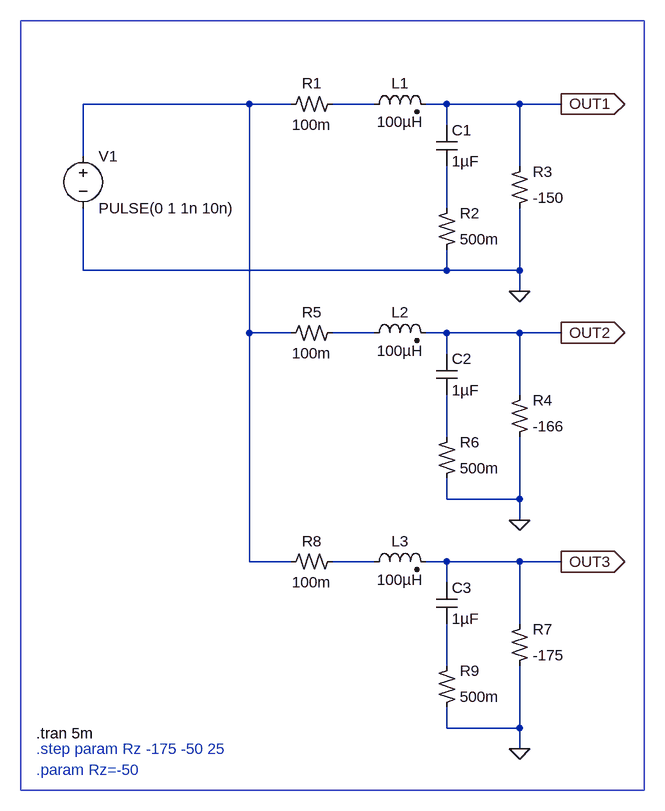
[diagram p0: schematic Switch-Mode Power Supplies - Basso- Figure 1-51.asc]
Switch-Mode Power Supplies - Basso- Figure 1-51.asc, the LTspice schematic file:
Version 4
SHEET 1 880 1052
WIRE -1632 -832 -1888 -832
WIRE -1568 -832 -1632 -832
WIRE -1440 -832 -1504 -832
WIRE -1328 -832 -1360 -832
WIRE -1216 -832 -1328 -832
WIRE -1152 -832 -1216 -832
WIRE -1328 -800 -1328 -832
WIRE -1888 -752 -1888 -832
WIRE -1216 -736 -1216 -832
WIRE -1328 -672 -1328 -736
WIRE -1888 -576 -1888 -672
WIRE -1328 -576 -1328 -608
WIRE -1328 -576 -1888 -576
WIRE -1216 -576 -1216 -672
WIRE -1216 -576 -1328 -576
WIRE -1216 -544 -1216 -576
WIRE -1632 -480 -1632 -832
WIRE -1568 -480 -1632 -480
WIRE -1440 -480 -1504 -480
WIRE -1328 -480 -1360 -480
WIRE -1216 -480 -1328 -480
WIRE -1152 -480 -1216 -480
WIRE -1328 -448 -1328 -480
WIRE -1216 -384 -1216 -480
WIRE -1328 -320 -1328 -384
WIRE -1328 -224 -1328 -256
WIRE -1216 -224 -1216 -320
WIRE -1216 -224 -1328 -224
WIRE -1216 -192 -1216 -224
WIRE -1632 -128 -1632 -480
WIRE -1568 -128 -1632 -128
WIRE -1440 -128 -1504 -128
WIRE -1328 -128 -1360 -128
WIRE -1216 -128 -1328 -128
WIRE -1152 -128 -1216 -128
WIRE -1328 -96 -1328 -128
WIRE -1216 -32 -1216 -128
WIRE -1328 32 -1328 -32
WIRE -1328 128 -1328 96
WIRE -1216 128 -1216 32
WIRE -1216 128 -1328 128
WIRE -1216 160 -1216 128
FLAG -1216 -544 0
FLAG -1152 -832 OUT1
IOPIN -1152 -832 Out
FLAG -1216 -192 0
FLAG -1152 -480 OUT2
IOPIN -1152 -480 Out
FLAG -1216 160 0
FLAG -1152 -128 OUT3
IOPIN -1152 -128 Out
SYMBOL res2 -1232 -672 M180
WINDOW 0 36 56 Left 0
WINDOW 3 36 16 Left 0
SYMATTR InstName R3
SYMATTR Value -150
SYMBOL ind2 -1456 -816 R270
WINDOW 0 32 56 VTop 0
WINDOW 3 4 56 VBottom 0
SYMATTR InstName L1
SYMATTR Value 100µH
SYMBOL cap -1344 -800 R0
SYMATTR InstName C1
SYMATTR Value 1µF
SYMBOL voltage -1888 -768 R0
WINDOW 123 0 0 Left 0
WINDOW 39 0 0 Left 0
SYMATTR InstName V1
SYMATTR Value PULSE(0 1 1n 10n)
SYMBOL res2 -1504 -848 R90
WINDOW 0 0 32 VBottom 0
WINDOW 3 32 32 VTop 0
SYMATTR InstName R1
SYMATTR Value 100m
SYMBOL res2 -1344 -608 M180
WINDOW 0 36 56 Left 0
WINDOW 3 36 16 Left 0
SYMATTR InstName R2
SYMATTR Value 500m
SYMBOL res2 -1232 -320 M180
WINDOW 0 36 56 Left 0
WINDOW 3 36 16 Left 0
SYMATTR InstName R4
SYMATTR Value -166
SYMBOL ind2 -1456 -464 R270
WINDOW 0 32 56 VTop 0
WINDOW 3 4 56 VBottom 0
SYMATTR InstName L2
SYMATTR Value 100µH
SYMBOL cap -1344 -448 R0
SYMATTR InstName C2
SYMATTR Value 1µF
SYMBOL res2 -1504 -496 R90
WINDOW 0 0 32 VBottom 0
WINDOW 3 32 32 VTop 0
SYMATTR InstName R5
SYMATTR Value 100m
SYMBOL res2 -1344 -256 M180
WINDOW 0 36 56 Left 0
WINDOW 3 36 16 Left 0
SYMATTR InstName R6
SYMATTR Value 500m
SYMBOL res2 -1232 32 M180
WINDOW 0 36 56 Left 0
WINDOW 3 36 16 Left 0
SYMATTR InstName R7
SYMATTR Value -175
SYMBOL ind2 -1456 -112 R270
WINDOW 0 32 56 VTop 0
WINDOW 3 4 56 VBottom 0
SYMATTR InstName L3
SYMATTR Value 100µH
SYMBOL cap -1344 -96 R0
SYMATTR InstName C3
SYMATTR Value 1µF
SYMBOL res2 -1504 -144 R90
WINDOW 0 0 32 VBottom 0
WINDOW 3 32 32 VTop 0
SYMATTR InstName R8
SYMATTR Value 100m
SYMBOL res2 -1344 96 M180
WINDOW 0 36 56 Left 0
WINDOW 3 36 16 Left 0
SYMATTR InstName R9
SYMATTR Value 500m
TEXT -1960 136 Left 0 !.tran 5m
TEXT -1960 160 Left 0 ;.step param Rz -175 -50 25
TEXT -1960 192 Left 0 ;.param Rz=-50
RECTANGLE Normal -1984 -960 -1024 224

The netlist it stands for:
* Switch-Mode Power Supplies - Basso- Figure 1-51.asc
R3 0 OUT1 -150
L1 N002 OUT1 100µH
C1 OUT1 N003 1µF
V1 N001 0 PULSE(0 1 1n 10n)
R1 N002 N001 100m
R2 0 N003 500m
R4 0 OUT2 -166
L2 N004 OUT2 100µH
C2 OUT2 N005 1µF
R5 N004 N001 100m
R6 0 N005 500m
R7 0 OUT3 -175
L3 N006 OUT3 100µH
C3 OUT3 N007 1µF
R8 N006 N001 100m
R9 0 N007 500m
.tran 5m
* .step param Rz -175 -50 25
* .param Rz=-50
.backanno
.end